# EAGLE design gameduino (EAGLE 5.11)
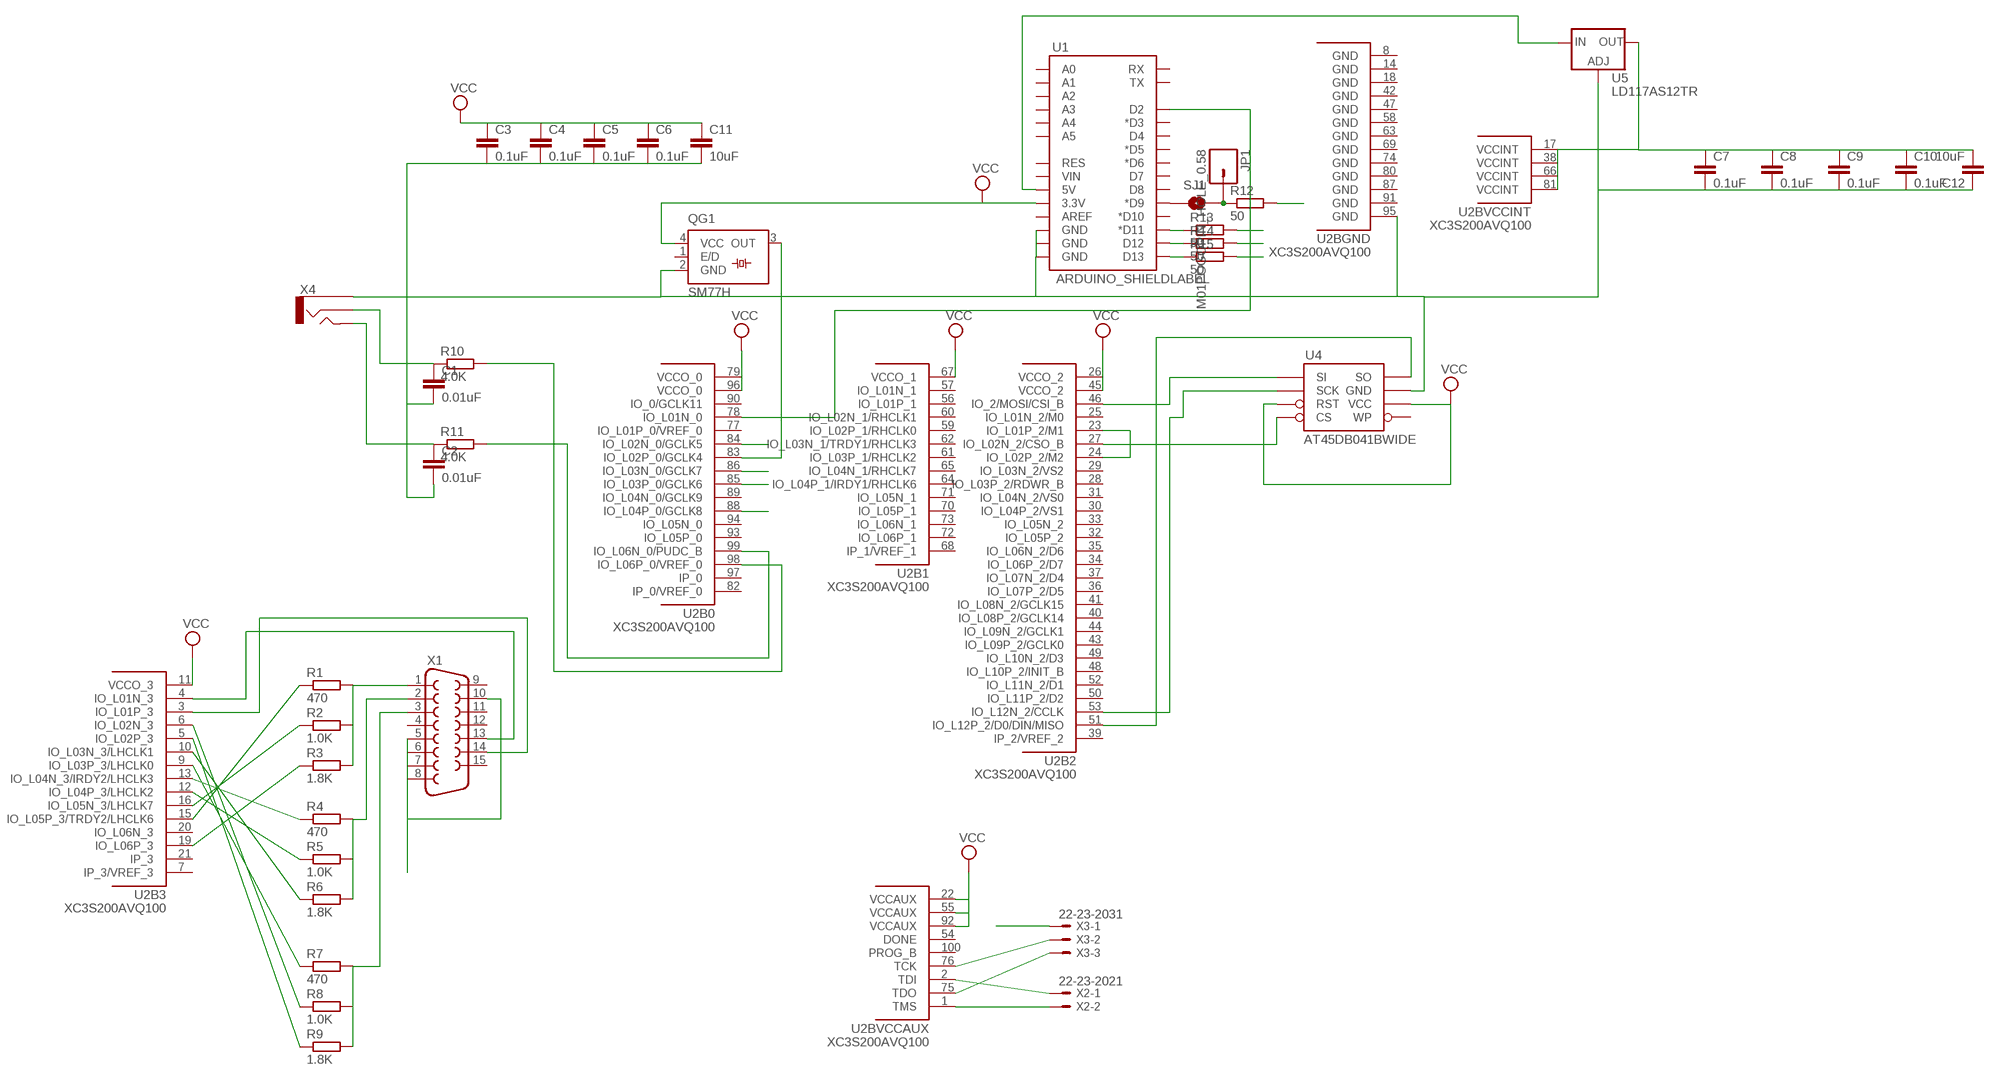
[diagram p0: schematic, sheet 1]

## Parts
C1  0.01uF  C-EUC0402  [C0402]
C2  0.01uF  C-EUC0402  [C0402]
C3  0.1uF  C-EUC0402  [C0402]
C4  0.1uF  C-EUC0402  [C0402]
C5  0.1uF  C-EUC0402  [C0402]
C6  0.1uF  C-EUC0402  [C0402]
C7  0.1uF  C-EUC0402  [C0402]
C8  0.1uF  C-EUC0402  [C0402]
C9  0.1uF  C-EUC0402  [C0402]
C10  0.1uF  C-EUC0402  [C0402]
C11  10uF  C-EUC1206  [C1206]
C12  10uF  C-EUC1206  [C1206]
JP1  M01POGOPIN_HOLE_0.58  [1X01_POGOPIN_HOLE_0.58]
QG1  SM77H  [SM77H]
R1  470  R-EU_R0402  [R0402]
R2  1.0K  R-EU_R0402  [R0402]
R3  1.8K  R-EU_R0402  [R0402]
R4  470  R-EU_R0402  [R0402]
R5  1.0K  R-EU_R0402  [R0402]
R6  1.8K  R-EU_R0402  [R0402]
R7  470  R-EU_R0402  [R0402]
R8  1.0K  R-EU_R0402  [R0402]
R9  1.8K  R-EU_R0402  [R0402]
R10  4.0K  R-EU_R0402  [R0402]
R11  4.0K  R-EU_R0402  [R0402]
R12  50  R-EU_R0402  [R0402]
R13  50  R-EU_R0402  [R0402]
R14  50  R-EU_R0402  [R0402]
R15  50  R-EU_R0402  [R0402]
SJ1  SOLDERJUMPERTRACE  [SJ_2S-TRACE]
U1  ARDUINO_SHIELDLABEL  [DUEMILANOVE_SHIELD]
U2  XC3S200AVQ100  [VQ100]
U4  AT45DB041BWIDE  [SO08WIDE]
U5  LD117AS12TR  [SOT223]
X1  F15HDH  [HDF15H]
X2  22-23-2021  [22-23-2021]
X3  22-23-2031  [22-23-2031]
X4  AUDIO-JACKPTH  [AUDIO-JACK]

## Nets
CLKA: QG1.3(OUT) U2.83(B0:IO_L02P_0/GCLK4)
GND: C1.2 C2.2 C3.2 C4.2 C5.2 C6.2 C7.2 C8.2 C9.2 C10.2 C11.2 C12.1 QG1.2(GND) U1.GND@0(GND) U1.GND@1(GND) U1.GND@2(GND) U2.23(B2:IO_L01P_2/M1) U2.24(B2:IO_L02P_2/M2) U2.95(BGND:GND) U4.7(GND) U5.1(ADJ) X1.5 X1.6 X1.7 X1.8 X1.10 X3.1 X4.1
MISO: R14.2 U2.86(B0:IO_L03N_0/GCLK7)
MOSI: R13.2 U2.85(B0:IO_L03P_0/GCLK6)
N$1: U2.46(B2:IO_2/MOSI/CSI_B) U4.1(SI)
N$2: U2.51(B2:IO_L12P_2/D0/DIN/MISO) U4.8(SO)
N$3: U2.53(B2:IO_L12N_2/CCLK) U4.2(SCK)
N$4: U2.27(B2:IO_L02N_2/CSO_B) U4.4(CS)
N$5: R1.2 R2.2 R3.2 X1.1
N$6: R4.2 R5.2 R6.2 X1.2
N$7: U1.5V U5.3(IN)
N$8: R7.2 R8.2 R9.2 X1.3
N$9: R9.1 U2.5(B3:IO_L02P_3)
N$10: U2.4(B3:IO_L01N_3) X1.13
N$11: U2.3(B3:IO_L01P_3) X1.14
N$12: R8.1 U2.6(B3:IO_L02N_3)
N$13: R7.1 U2.9(B3:IO_L03P_3/LHCLK0)
N$14: U2.1(BVCCAUX:TMS) X2.2
N$15: U2.2(BVCCAUX:TDI) X2.1
N$16: U2.75(BVCCAUX:TDO) X3.3
N$17: U2.76(BVCCAUX:TCK) X3.2
N$18: C1.1 R10.1 X4.2
N$19: C2.1 R11.1 X4.5
N$20: SJ1.1 U1.D9(*D9)
N$21: R11.2 U2.99(B0:IO_L06N_0/PUDC_B)
N$22: R10.2 U2.98(B0:IO_L06P_0/VREF_0)
N$23: JP1.1 R12.1 SJ1.2
N$24: R13.1 U1.D11(*D11)
N$25: R14.1 U1.D12
N$26: R15.1 U1.D13
N$27: R6.1 U2.10(B3:IO_L03N_3/LHCLK1)
N$28: R5.1 U2.12(B3:IO_L04P_3/LHCLK2)
N$29: R4.1 U2.13(B3:IO_L04N_3/IRDY2/LHCLK3)
N$30: R1.1 U2.15(B3:IO_L05P_3/TRDY2/LHCLK6)
N$31: R2.1 U2.16(B3:IO_L05N_3/LHCLK7)
N$32: R3.1 U2.19(B3:IO_L06P_3)
N$33: U1.D2 U2.78(B0:IO_L01N_0)
SCK: R15.2 U2.84(B0:IO_L02N_0/GCLK5)
SSEL: R12.2 U2.88(B0:IO_L04P_0/GCLK8)
VCC: C3.1 C4.1 C5.1 C6.1 C11.1 QG1.4(VCC) U1.3.3V U2.11(B3:VCCO_3) U2.22(BVCCAUX:VCCAUX) U2.26(B2:VCCO_2) U2.45(B2:VCCO_2) U2.55(BVCCAUX:VCCAUX) U2.67(B1:VCCO_1) U2.79(B0:VCCO_0) U2.92(BVCCAUX:VCCAUX) U2.96(B0:VCCO_0) U4.3(RST) U4.6(VCC)
VCCINT: C7.1 C8.1 C9.1 C10.1 C12.2 U2.17(BVCCINT:VCCINT) U2.38(BVCCINT:VCCINT) U2.66(BVCCINT:VCCINT) U2.81(BVCCINT:VCCINT) U5.4(OUT)
Unconnected: QG1.1(E/D) U1.A0 U1.A1 U1.A2 U1.A3 U1.A4 U1.A5 U1.AREF U1.D3(*D3) U1.D4 U1.D5(*D5) U1.D6(*D6) U1.D7 U1.D8 U1.D10(*D10) U1.RES U1.RX U1.TX U1.VIN U2.7(B3:IP_3/VREF_3) U2.20(B3:IO_L06N_3) U2.21(B3:IP_3) U2.25(B2:IO_L01N_2/M0) U2.28(B2:IO_L03P_2/RDWR_B) U2.29(B2:IO_L03N_2/VS2) U2.30(B2:IO_L04P_2/VS1) U2.31(B2:IO_L04N_2/VS0) U2.32(B2:IO_L05P_2) U2.33(B2:IO_L05N_2) U2.34(B2:IO_L06P_2/D7) U2.35(B2:IO_L06N_2/D6) U2.36(B2:IO_L07P_2/D5) U2.37(B2:IO_L07N_2/D4) U2.39(B2:IP_2/VREF_2) U2.40(B2:IO_L08P_2/GCLK14) U2.41(B2:IO_L08N_2/GCLK15) U2.43(B2:IO_L09P_2/GCLK0) U2.44(B2:IO_L09N_2/GCLK1) U2.48(B2:IO_L10P_2/INIT_B) U2.49(B2:IO_L10N_2/D3) U2.50(B2:IO_L11P_2/D2) U2.52(B2:IO_L11N_2/D1) U2.54(BVCCAUX:DONE) U2.56(B1:IO_L01P_1) U2.57(B1:IO_L01N_1) U2.59(B1:IO_L02P_1/RHCLK0) U2.60(B1:IO_L02N_1/RHCLK1) U2.61(B1:IO_L03P_1/RHCLK2) U2.62(B1:IO_L03N_1/TRDY1/RHCLK3) U2.64(B1:IO_L04P_1/IRDY1/RHCLK6) U2.65(B1:IO_L04N_1/RHCLK7) U2.68(B1:IP_1/VREF_1) U2.70(B1:IO_L05P_1) U2.71(B1:IO_L05N_1) U2.72(B1:IO_L06P_1) U2.73(B1:IO_L06N_1) U2.77(B0:IO_L01P_0/VREF_0) U2.82(B0:IP_0/VREF_0) U2.89(B0:IO_L04N_0/GCLK9) U2.90(B0:IO_0/GCLK11) U2.93(B0:IO_L05P_0) U2.94(B0:IO_L05N_0) U2.97(B0:IP_0) U2.100(BVCCAUX:PROG_B) U4.5(WP) X1.4 X1.9 X1.11 X1.12 X1.15

## Power pins joined to a net without a drawn wire
GND: U2.8(BGND:GND) U2.14(BGND:GND) U2.18(BGND:GND) U2.42(BGND:GND) U2.47(BGND:GND) U2.58(BGND:GND) U2.63(BGND:GND) U2.69(BGND:GND) U2.74(BGND:GND) U2.80(BGND:GND) U2.87(BGND:GND) U2.91(BGND:GND)

## Library data of the parts
C1-C12 = rcl:C-EU: CAPACITOR, European symbol
JP1 = SparkFun:M01: Header 1 Standard 1-pin 0.1" header. Use with straight break away headers (SKU : PRT-00116), right angle break away headers (PRT-00553), swiss pins (PRT-00743), machine pins (PRT-00117), and female headers (PRT-00115).
QG1 = crystal:SM77H: 3.3V CMOS Clock Oscillator Source: www.pletronics.com .. sm77h%203.3v.pdf; OC_FARNELL: unknown; OC_NEWARK: unknown
R1-R15 = resistor:R-EU_: RESISTOR, European symbol
SJ1 = SparkFun:SOLDERJUMPER: Solder Jumper Standard SMD solder jumper. Used to automate production. Two varients : Normally Open and Normally Closed are the same, but have different paste layers. NC will have a large amount of paste and should jumper during reflow.
U1 = SparkFun:ARDUINO_SHIELD
U2 = xilinx_devices:XC3S200AVQ100: Xilinx FPGA: XC3S200AVQ100
U4 = SparkFun:AT45DB041B
U5 = v-reg:LD117A?*: Low drop fixed and adjustable positive voltage regulators 1 A Source: http://www.st.com/stonline/products/literature/ds/7194/ld1117axx.pdf
X1 = adafruit:F15: SUB-D HDH is also known as a 'right angle VGA' connector
X2 = con-molex:22-23-2021: .100" (2.54mm) Center Header - 2 Pin
X3 = con-molex:22-23-2031: .100" (2.54mm) Center Header - 3 Pin
X4 = SparkFun:AUDIO-JACK: 3.5mm Audio Jack Simple 3.5mm common PCB mount audio jack. SKU: PRT-08032

## Board
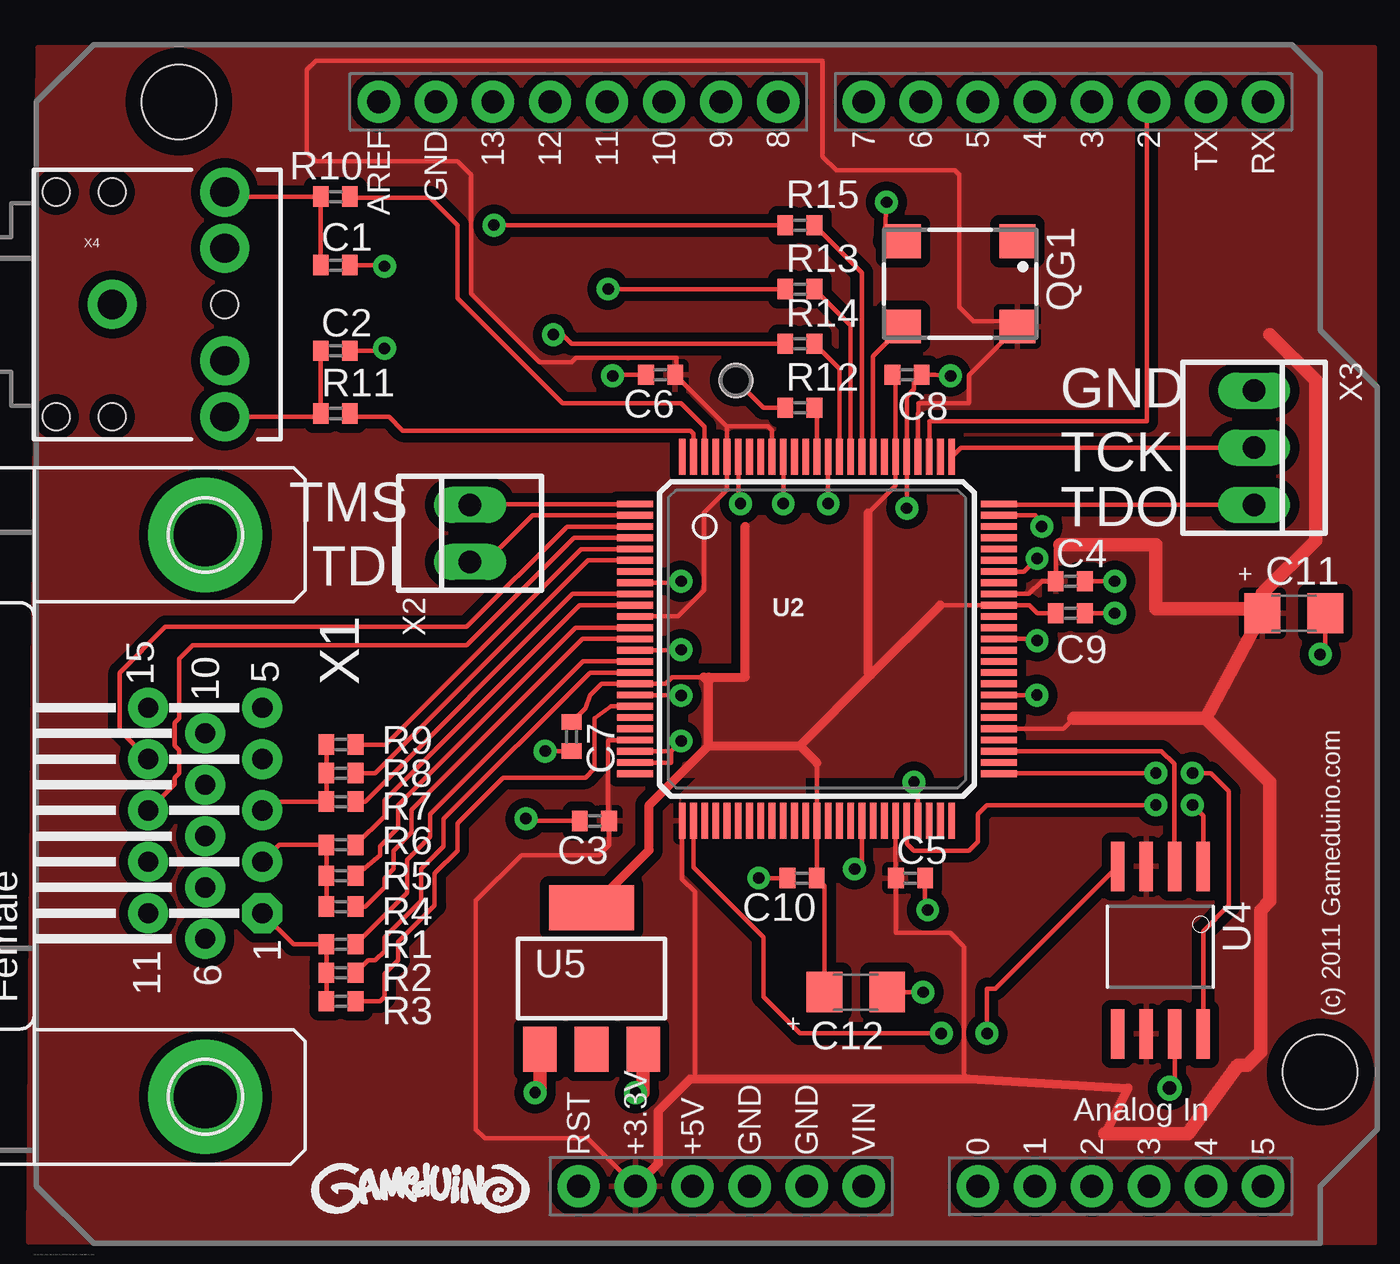
[diagram p1: board, top side]
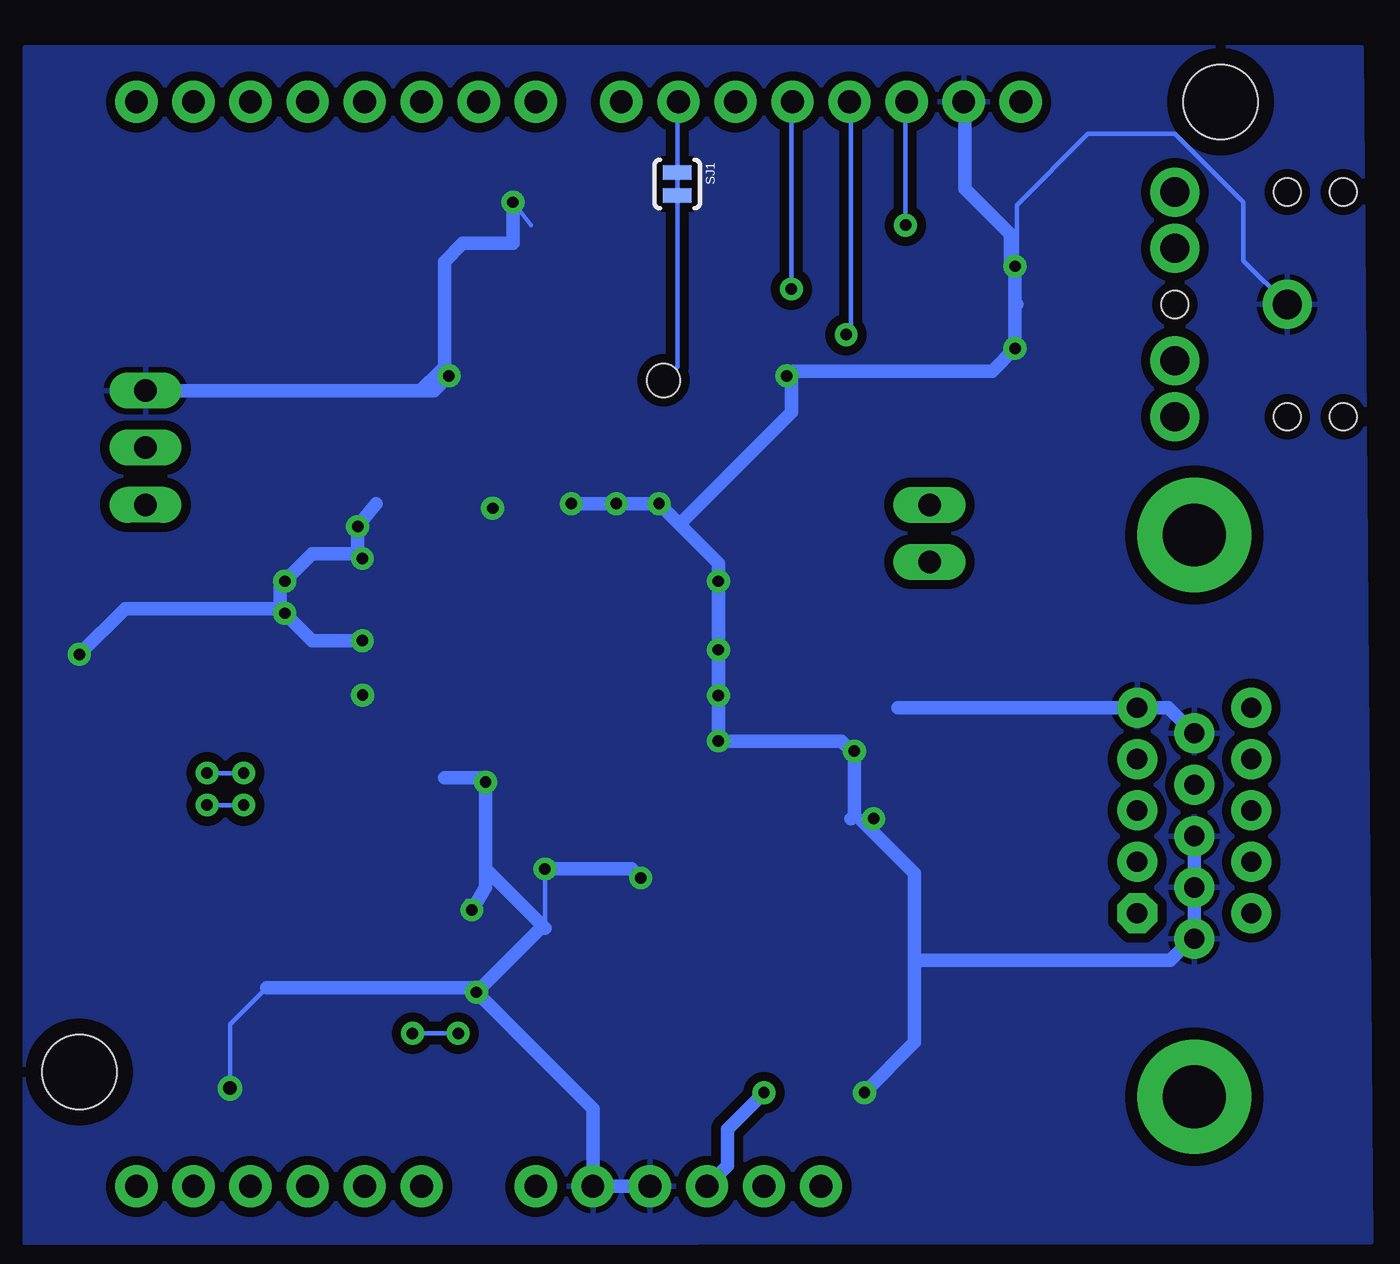
[diagram p2: board, bottom side, seen from below]

No outline drawn. Coordinates in mm, seen from the top.
Copper layers (1*16): Top 0.035mm / dielectric 1.5mm / Bottom 0.035mm
Design rules "SparkFun": minimum track width 8mil, minimum drill 20mil, track to track 8mil, track to pad 8mil, pad to pad 8mil, via to via 8mil, smd to smd 8mil, copper to edge 10mil, drill to drill 8mil, minimum pad ring 12mil, minimum via ring 10mil, stop-mask expansion 4mil, vias tented up to drill 25mil, thermal gap 10mil

### Footprints (pad centres in the part's own frame; a part is rotated, then mirrored left to right if it is on the bottom)
C0402 = smd 0.7 x 0.9: 1 -0.65,0; 2 0.65,0
C1206 = smd 1.6 x 1.8: 1 -1.4,0; 2 1.4,0
1X01_POGOPIN_HOLE_0.58 = drill 0.9 pad 0.813 round: 1 0,0 | hole 1.473: 0,0
SM77H = smd 1.6 x 1.5: 1 -2.55,-1.9; 2 2.55,-1.9; 3 2.55,1.9; 4 -2.55,1.9
R0402 = smd 0.7 x 0.9: 1 -0.65,0; 2 0.65,0
SJ_2S-TRACE = smd 0.635 x 1.27: 1 -0.508,0; 2 0.508,0
DUEMILANOVE_SHIELD = drill 1.016 pad 1.88 round: 3.3V 50.8,26.67; 5V 50.8,29.21; A0 50.8,41.91; A1 50.8,44.45; A2 50.8,46.99; A3 50.8,49.53; A4 50.8,52.07; A5 50.8,54.61; AREF 2.54,15.24; D2 2.54,49.53; D3 2.54,46.99; D4 2.54,44.45; D5 2.54,41.91; D6 2.54,39.37; D7 2.54,36.83; D8 2.54,33.02; D9 2.54,30.48; D10 2.54,27.94; D11 2.54,25.4; D12 2.54,22.86; D13 2.54,20.32; GND@0 50.8,31.75; GND@1 50.8,34.29; GND@2 2.54,17.78; RES 50.8,24.13; RX 2.54,54.61; TX 2.54,52.07; VIN 50.8,36.83 | hole 3.302: 45.72,57.15; 2.54,6.35
VQ100 = smd 1.6 x 0.3: 1 -8.1,6; 2 -8.1,5.5; 3 -8.1,5; 4 -8.1,4.5; 5 -8.1,4; 6 -8.1,3.5; 7 -8.1,3; 8 -8.1,2.5; 9 -8.1,2; 10 -8.1,1.5; 11 -8.1,1; 12 -8.1,0.5; 13 -8.1,0; 14 -8.1,-0.5; 15 -8.1,-1; 16 -8.1,-1.5; 17 -8.1,-2; 18 -8.1,-2.5; 19 -8.1,-3; 20 -8.1,-3.5; 21 -8.1,-4; 22 -8.1,-4.5; 23 -8.1,-5; 24 -8.1,-5.5; 25 -8.1,-6; 51 8.1,-6; 52 8.1,-5.5; 53 8.1,-5; 54 8.1,-4.5; 55 8.1,-4; 56 8.1,-3.5; 57 8.1,-3; 58 8.1,-2.5; 59 8.1,-2; 60 8.1,-1.5; 61 8.1,-1; 62 8.1,-0.5; 63 8.1,0; 64 8.1,0.5; 65 8.1,1; 66 8.1,1.5; 67 8.1,2; 68 8.1,2.5; 69 8.1,3; 70 8.1,3.5; 71 8.1,4; 72 8.1,4.5; 73 8.1,5; 74 8.1,5.5; 75 8.1,6 | smd 0.3 x 1.6: 26 -6,-8.1; 27 -5.5,-8.1; 28 -5,-8.1; 29 -4.5,-8.1; 30 -4,-8.1; 31 -3.5,-8.1; 32 -3,-8.1; 33 -2.5,-8.1; 34 -2,-8.1; 35 -1.5,-8.1; 36 -1,-8.1; 37 -0.5,-8.1; 38 0,-8.1; 39 0.5,-8.1; 40 1,-8.1; 41 1.5,-8.1; 42 2,-8.1; 43 2.5,-8.1; 44 3,-8.1; 45 3.5,-8.1; 46 4,-8.1; 47 4.5,-8.1; 48 5,-8.1; 49 5.5,-8.1; 50 6,-8.1; 76 6,8.1; 77 5.5,8.1; 78 5,8.1; 79 4.5,8.1; 80 4,8.1; 81 3.5,8.1; 82 3,8.1; 83 2.5,8.1; 84 2,8.1; 85 1.5,8.1; 86 1,8.1; 87 0.5,8.1; 88 0,8.1; 89 -0.5,8.1; 90 -1,8.1; 91 -1.5,8.1; 92 -2,8.1; 93 -2.5,8.1; 94 -3,8.1; 95 -3.5,8.1; 96 -4,8.1; 97 -4.5,8.1; 98 -5,8.1; 99 -5.5,8.1; 100 -6,8.1
SO08WIDE = smd 0.61 x 2.21: 1 -1.905,-3.569; 2 -0.635,-3.569; 3 0.635,-3.569; 4 1.905,-3.569; 5 1.905,3.886; 6 0.635,3.886; 7 -0.635,3.886; 8 -1.905,3.886
SOT223 = smd 1.5 x 2: 1 -2.3,-3.15; 2 0,-3.15; 3 2.3,-3.15 | smd 3.8 x 2: 4 0,3.15
HDF15H = drill 0.9 pad 1.778 octagon: 1 4.329,2.54 | drill 0.9 pad 1.778 round: 2 2.043,2.54; 3 -0.243,2.54; 4 -2.529,2.54; 5 -4.815,2.54; 6 5.472,0; 7 3.186,0; 8 0.9,0; 9 -1.386,0; 10 -3.672,0; 11 4.329,-2.54; 12 2.043,-2.54; 13 -0.243,-2.54; 14 -2.529,-2.54; 15 -4.815,-2.54 | drill 2.8 pad 5.08 round: P$1 -12.5,0; P$2 12.5,0
22-23-2021 = drill 1 long: 1 -1.27,0; 2 1.27,0
22-23-2031 = drill 1 long: 1 -2.54,0; 2 0,0; 3 2.54,0
AUDIO-JACK = drill 1.3 pad 2.184 round: 1 0,0; 2 5,5; 3 5,2.5; 4 5,-2.5; 5 5,-5 | hole 1.2: 0,5; -2.5,5; -2.5,-5; 0,-5; 5,0

### Placement (x,y rotation side)
C1  13.46,43.94 0 top
C2  13.46,40.13 0 top
C3  24.99,19.2 180 top
C4  46.18,29.87 0 top
C5  39.07,16.66 0 top
C6  27.94,39.07 180 top
C7  23.98,22.96 270 top
C8  38.91,39.07 0 top
C9  46.18,28.45 0 top
C10  34.24,16.66 180 top
C11  56.13,28.45 0 top
C12  36.63,11.58 180 top
JP1  31.29,38.81 0 top
QG1  41.27,43.1 180 top
R1  13.72,13.72 180 top
R2  13.72,12.45 180 top
R3  13.72,11.18 180 top
R4  13.72,15.39 180 top
R5  13.72,16.76 180 top
R6  13.72,18.14 180 top
R7  13.72,20.07 180 top
R8  13.72,21.34 180 top
R9  13.72,22.61 180 top
R10  13.46,46.99 0 top
R11  13.46,37.34 0 top
R12  34.14,37.59 0 top
R13  34.14,42.88 0 top
R14  34.14,40.44 0 top
R15  34.14,45.72 0 top
SJ1  30.68,47.55 270 bottom
U1  0.15,53.75 270 top
U2  34.9,27.3 0 top
U4  50.19,13.61 180 top
U5  24.87,12.19 0 top
X1  7.67,19.43 270 top
X2  19.46,32 90 top
X3  54.36,35.81 270 top
X4  3.53,42.19 0 top

### Tracks (layer width: path | path; a pad name or v marks a point on that pad's centre or on a via)
CLKA
  Top 0.203: U2.83 37.4,39.88 QG1.3
GND  (via drill 0.51 pad 0.71, 0.6)
  Top 0.203: U2.42 36.9,17.39 v36.58,17.07 | v22.8,22.31 C7.2 | U2.18 28.84,24.8 v28.85,24.79 | U2.14 28.85,26.8 v28.85,26.82 | U2.8 28.85,29.8 v28.85,29.87 | U2.95 31.4,33.33 v31.5,33.33 | v33.4,33.33 U2.91 | v35.4,33.33 U2.87 | v38.9,33.12 U2.80 38.9,38.09 39.22,38.41 39.22,38.72 C8.2 40.18,39.06 v40.84,39.01 | U2.74 44.61,32.8 v44.91,32.31 | QG1.2 37.9,45 v38,46.74 | v48.16,29.87 C4.2 | v48.16,28.45 C9.2 | U2.69 44.12,30.3 v44.7,30.89 | U2.63 44.63,27.3 v44.7,27.23 | U2.58 v44.69,24.8 | 28.4,22.3 U2.23 | v28.85,22.76 28.4,22.3 | C5.2 39.72,15.76 v39.83,15.24 | C2.2 15.54,40.13 v15.65,40.23 | C1.2 15.6,43.94 v15.65,43.89 | C6.2 25.86,39.06 v25.81,39.01 | C11.2 57.53,26.85 v57.3,26.62 | v39.62,11.58 C12.1 | U2.47 39.4,20.75 v39.22,20.93 | v32.31,16.66 C10.2 | C3.2 22.05,19.2 v21.95,19.3 | U2.24 28.4,21.8 28.4,22.3 | v50.6,7.32 50.83,7.54 U4.7
  Top 0.61: U5.1 22.57,7.33 v22.35,7.11
  Bottom 0.203: 36.58,14.43 v36.58,17.07 | v28.85,24.79 28.85,24.99 | v28.85,26.82 28.85,27.03 | v28.85,29.87 28.85,30.07 | v31.5,33.33 31.7,33.33 | v44.91,32.31 45.11,32.51 | v40.84,39.01 41.05,39.01 | v38,46.74 37.19,45.72 | v48.16,29.87 48.36,30.07 | v48.16,28.45 48.36,28.65 | 44.91,31.09 v44.7,30.89 | v44.7,27.23 44.91,27.23 | v28.85,22.76 28.85,22.96 | v39.83,15.24 40.03,15.65 | v15.65,40.23 15.85,40.23 | v15.65,43.89 15.85,43.89 | 25.6,39.22 v25.81,39.01 | v57.3,26.62 57.3,26.42 | v39.62,11.58 39.83,11.79 | 39.22,21.13 v39.22,20.93 | v32.31,16.66 32.11,16.46 | 22.96,22.35 22.84,22.35 v22.8,22.31 | 15.57,42.19 15.57,46.61 12.39,49.78 8.53,49.78 5.49,46.74 5.49,44.15 X4.1 | v21.95,19.3 22.6,19.3 22.8,19.51 | 48.97,11.79 50.6,10.16 v50.6,7.32
  Bottom 0.61: 22.15,7.11 v22.35,7.11 20.12,9.35 20.12,12.8 | U1.GND@0 U1.GND@1 34.44,6.4 v39.62,11.58 36.78,14.43 36.58,14.43 39.22,17.07 | 39.83,11.79 48.97,11.79 | v36.58,17.07 32.72,17.07 v32.31,16.66 | 39.22,17.07 39.22,16.26 v39.83,15.24 | 39.22,17.07 39.22,21.13 41.05,21.13 | v44.7,27.23 44.69,27.21 | 44.91,27.23 46.94,27.23 v48.16,28.45 | v57.3,26.62 55.27,28.65 48.36,28.65 48.36,29.67 v48.16,29.87 46.94,31.09 44.91,31.09 v44.91,32.31 44.09,33.33 | v35.4,33.33 v33.4,33.33 31.7,33.33 | 28.85,30.07 28.85,30.68 30.58,32.41 | 30.58,32.41 v31.5,33.33 | 28.85,27.03 v28.85,29.87 | 28.85,24.99 v28.85,26.82 | 28.85,22.96 v28.85,24.79 | X1.10 8.81,24.25 X1.5 20.86,24.25 | X1.6 X1.7 X1.8 7.67,14.07 8.74,13.01 19.91,13.01 20.12,12.8 | v22.8,22.31 22.8,19.51 22.8,19.47 22.96,19.3 | 22.45,19.2 20.12,16.87 20.12,12.8 | 22.96,22.35 23.37,22.76 v28.85,22.76 | 30.58,32.41 25.6,37.39 25.6,39.22 16.66,39.22 v15.65,40.23 15.65,42.27 | 15.65,42.27 v15.65,43.89 | 15.85,43.89 15.85,45.31 17.88,47.35 17.88,51.16 U1.GND@2 | X3.1 41.5,38.35 v40.84,39.01 | 15.65,42.27 15.57,42.19 | 41.25,39.22 41.05,39.42 41.05,44.09 40.23,44.91 38,44.91 v38,46.74 | 41.25,39.22 42.06,38.41 | 41.05,39.01 41.25,39.22
  pour Bottom (isolate 0.406): 0.2,53.64 -0.2,0.46 59.74,0.41 59.74,53.64
MISO
  Top 0.203: U2.86 35.9,39.33 R14.2
MOSI
  Top 0.203: U2.85 36.4,41.26 R13.2
N$1  (via drill 0.51 pad 0.71)
  Top 0.203: v51.61,19.91 52.09,19.43 U4.1 | v49.99,19.91 42.47,19.91 42.06,19.51 42.06,18.29 41.66,17.88 39.22,17.88 38.9,18.2 U2.46
  Bottom 0.203: v49.99,19.91 v51.61,19.91
N$2  (via drill 0.51 pad 0.71)
  Top 0.203: v51.61,21.34 52.43,21.34 53.24,20.52 53.24,15.44 52.09,14.3 U4.8 | v49.99,21.34 43.03,21.34 U2.51
  Bottom 0.203: v51.61,21.34 v49.99,21.34
N$3
  Top 0.203: U2.53 50.24,22.3 50.8,21.74 50.8,18.09 | 50.8,18.09 50.8,17.58 | U4.2 50.83,18.06 50.8,18.09
N$4  (via drill 0.51 pad 0.71)
  Top 0.203: U2.27 29.4,17.13 32.51,14.02 32.51,11.38 34.14,9.75 v40.44,9.75 | v42.47,9.75 42.47,11.73 42.84,11.73 U4.4
  Bottom 0.203: v40.44,9.75 v42.47,9.75
N$5
  Top 0.203: R3.2 R2.2 R1.2 11.6,13.72 X1.1
N$6
  Top 0.203: R4.2 R5.2 R6.2 10.96,18.14 X1.2
N$7  (via drill 0.51 pad 0.71)
  Top 0.61: v26.82,7.11 27.17,7.11 U5.3
  Bottom 0.61: U1.5V 28.45,3.86 28.45,5.49 v26.82,7.11
N$8
  Top 0.203: R9.2 R8.2 R7.2 10.6,20.07 X1.3
N$9
  Top 0.203: U2.5 24.4,31.3 15.7,22.61 R9.1
N$10
  Top 0.203: U2.4 24.08,31.8 19.3,27.03 7.11,27.03 6.5,26.42 6.5,23.77 6.3,23.57 6.3,22.55 6.5,22.35 6.5,21.34 6.3,21.13 6.3,20.84 X1.13
N$11
  Top 0.203: U2.3 23.77,32.3 19.3,27.84 5.89,27.84 3.86,25.81 3.86,23.23 X1.14
N$12
  Top 0.203: U2.6 24.71,30.8 15.24,21.34 R8.1
N$13
  Top 0.203: U2.9 24.02,29.3 14.78,20.07 R7.1
N$14
  Top 0.203: U2.1 20.1,33.3 X2.2
N$15
  Top 0.203: U2.2 22.24,32.8 20.17,30.73 X2.1
N$16
  Top 0.203: U2.75 43.03,33.27 X3.3
N$17
  Top 0.203: U2.76 41.31,35.81 X3.2
N$18
  Top 0.203: C1.1 R10.1 8.73,46.99 X4.2
N$19
  Top 0.203: C2.1 R11.1 12.66,37.19 X4.5
N$20
  Bottom 0.203: SJ1.1 30.68,51.16 U1.D9
N$21
  Top 0.203: U2.99 29.4,36.44 29.26,36.58 16.46,36.58 15.85,37.19 14.26,37.19 R11.2
N$22
  Top 0.203: R10.2 14.16,46.94 17.68,46.94 18.9,45.72 18.9,42.47 23.57,37.8 28.85,37.8 29.9,36.75 U2.98
N$23
  Top 0.203: R12.1 32.51,37.59 JP1.1
  Bottom 0.203: SJ1.2 30.68,39.42 JP1.1
N$24  (via drill 0.51 pad 0.71)
  Top 0.203: v25.6,42.88 R13.1
  Bottom 0.203: v25.6,42.88 25.6,51.16 U1.D11
N$25  (via drill 0.51 pad 0.71)
  Top 0.203: v23.16,40.84 23.57,40.84 23.98,40.44 R14.1
  Bottom 0.203: v23.16,40.84 23.16,41.05 22.96,41.25 22.96,51.16 U1.D12
N$26  (via drill 0.51 pad 0.71)
  Top 0.203: v20.52,45.72 R15.1
  Bottom 0.203: v20.52,45.72 20.52,51.16 U1.D13
N$27
  Top 0.203: U2.10 24.34,28.8 15.65,20.12 15.65,19.42 R6.1
N$28
  Top 0.203: U2.12 24.15,27.8 16.26,19.91 16.26,18.9 15.44,18.09 15.44,17.68 R5.1
N$29
  Top 0.203: U2.13 24.46,27.3 16.87,19.71 16.87,18.69 16.05,17.88 16.05,17.07 15.65,16.66 15.65,16.26 14.78,15.39 R4.1
N$30
  Top 0.203: U2.15 24.48,26.3 17.68,19.51 17.68,18.49 16.66,17.48 16.66,16.01 R1.1
N$31
  Top 0.203: U2.16 24.79,25.8 18.29,19.3 18.29,18.09 17.27,17.07 17.27,15.65 15.65,14.02 15.65,13.41 15.24,13.01 14.93,13.01 R2.1
N$32
  Top 0.203: U2.19 25.73,24.3 24.99,23.77 24.99,21.54 24.59,21.13 20.93,21.13 18.9,19.1 18.9,17.88 17.88,16.87 17.88,15.44 16.26,13.82 16.26,13.01 15.65,12.39 15.65,11.38 15.44,11.18 R3.1
N$33
  Top 0.203: U2.78 39.9,36.98 49.58,36.98 49.58,51.21 U1.D2
SCK
  Top 0.203: U2.84 36.9,43.61 R15.2
SSEL
  Top 0.203: U2.88 34.9,37.48 R12.2
VCC
  Top 0.203: 38.4,16.68 U2.45 | 38.4,16.68 C5.1 | U2.22 25.65,22.8 25.6,22.76 25.6,19.24 C3.1 25.64,18.12 25.2,17.68 21.74,17.68 19.71,15.65 19.71,5.49 20.12,5.08 24.69,5.08 U1.3.3V | U2.55 45.86,23.3 46.33,23.77 | U2.67 44.34,29.3 44.91,29.87 C4.1 45.53,31.3 45.72,31.5 | U2.79 39.4,36.96 39.42,37.8 41.66,37.8 41.66,39.03 QG1.4 43.58,41.45 41.86,41.45 41.25,42.06 41.25,47.95 41.05,48.16 35.76,48.16 35.15,48.77 35.15,53.03 12.6,53.03 12.19,52.63 12.19,48.97 12.6,48.56 18.9,48.56 19.51,47.95 19.51,42.67 22.55,39.62 23.98,39.62 24.18,39.83 28.65,39.83 28.65,39.01 28.64,39.01 C6.1 30.88,36.78 | U2.92 32.9,36.59 32.72,36.78 30.88,36.78 | 30.88,36.78 30.9,36.76 U2.96 30.89,35.39 30.89,33.93 29.87,32.92 29.87,29.46 28.71,28.3 U2.11 | 41.66,7.72 41.45,7.92 41.45,13.61 40.84,14.22 38.41,14.22 38.41,16.66 38.4,16.67 38.4,16.68 | U2.26 28.9,16.62 29.46,16.05 29.46,7.72 | 54.66,28.65 54.66,28.52 C11.1
  Top 0.406: U1.3.3V 27.84,3.96 27.84,6.3 29.26,7.72 29.46,7.72 41.66,7.72 48.74,7.32 47.73,5.28
  Top 0.61: 52.22,23.77 46.33,23.77 | 52.22,23.77 55.07,20.93 55.07,15.65 54.66,15.24 54.66,8.94 54.05,8.33 53.65,8.33 51.41,5.28 47.73,5.28 | 52.22,23.77 C11.1 54.73,29.33 57.1,31.7 57.1,38.81 55.07,40.84 | QG1.4 44.19,40.84 | 54.66,28.65 49.99,28.65 49.99,31.5 45.72,31.5
  pour Top (isolate 0.406): 0.2,53.64 -0.2,0.46 59.74,0.41 59.74,53.64
VCCINT
  Top 0.203: C7.1 24.59,24.22 24.79,24.79 25.3,25.3 U2.17 28.15,25.3 28.45,25.6 29.87,25.6 | C8.1 38.4,38.73 U2.81 38.4,34.13 37.19,32.92 | C9.1 44.7,28.45 44.35,28.8 U2.66 40.39,28.8 | 34.9,21.79 U2.38 34.9,16.67 C10.1 35.23,16.32 C12.2 | 37.29,25.7 37.19,25.81
  Top 0.406: U5.4 27.43,17.91 27.43,19.91 30.07,22.55 | 34.14,22.55 34.9,21.79 | 30.07,22.55 34.14,22.55 | 34.14,22.55 37.29,25.7 40.39,28.8 | 37.19,25.81 37.19,32.92 | 30.07,22.55 30.07,25.4 29.87,25.6 | 30.07,25.6 31.7,25.6 31.7,32.31
  pour Top (isolate 0.406): 28.65,21.34 41.25,21.34 41.25,33.53 31.7,33.53 31.7,25.4 28.65,25.4

### Text on the board
tNames: GND | TCK | TMS | TDO | TDI | + | (c) 2011 Gameduino.com | + | /u/jamesb/juiceboss/gameduino/synth/sketches/graphics/logo/gdmono.bmp